# EasyEDA Pro project ProPrj_农装B类小车V2_2025-10-25.epro, board _1
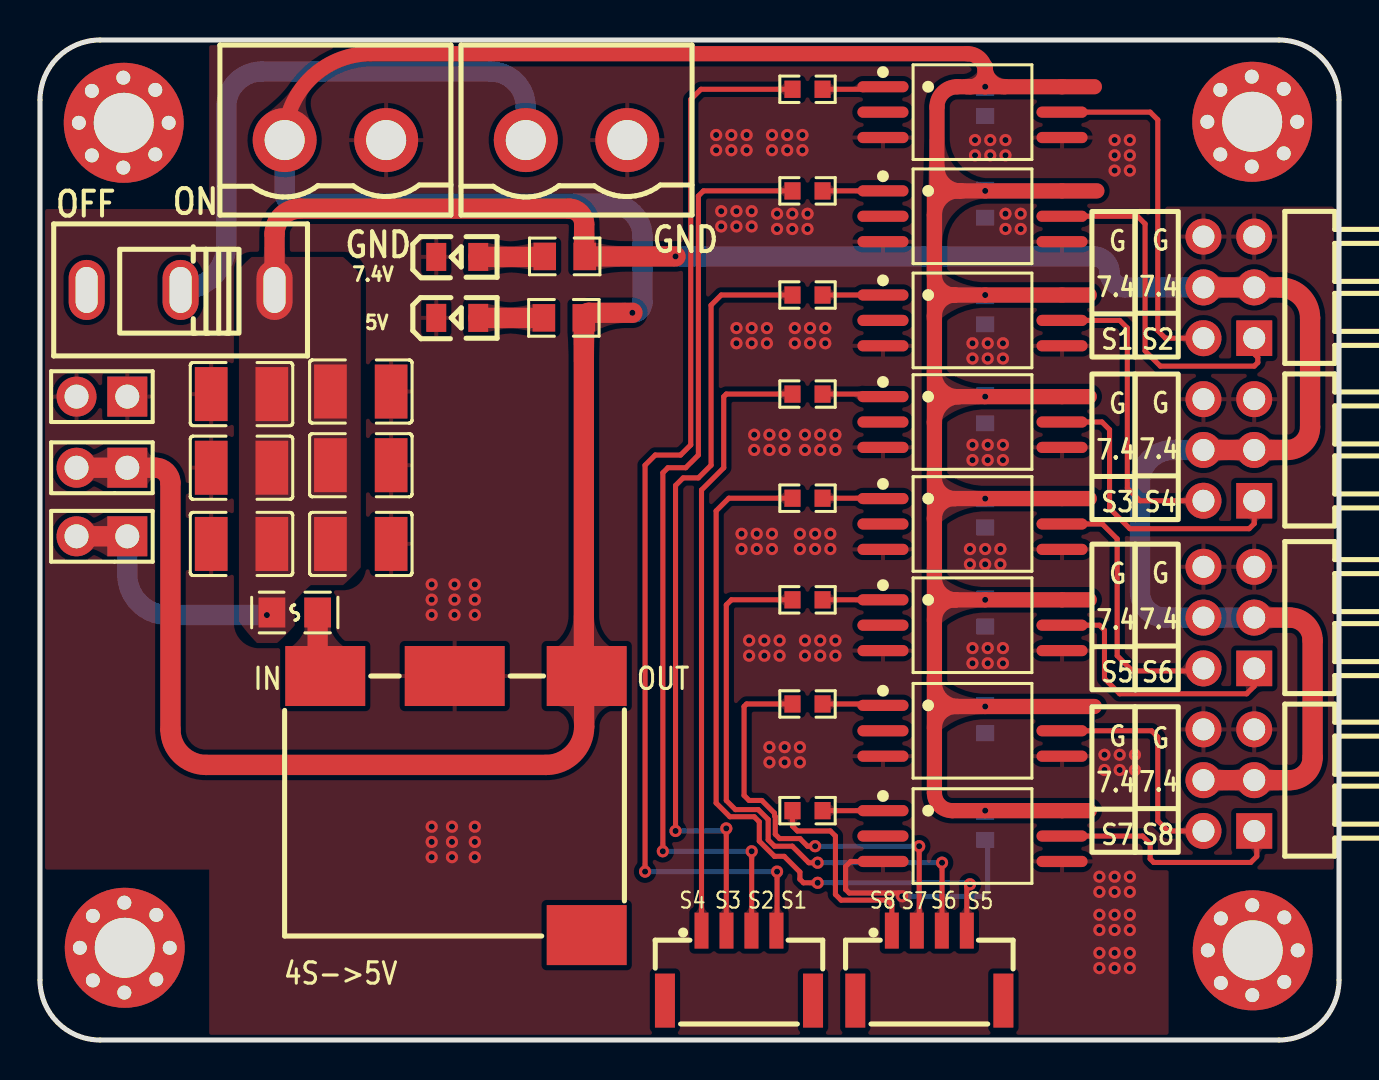
[diagram p6: board, top side]
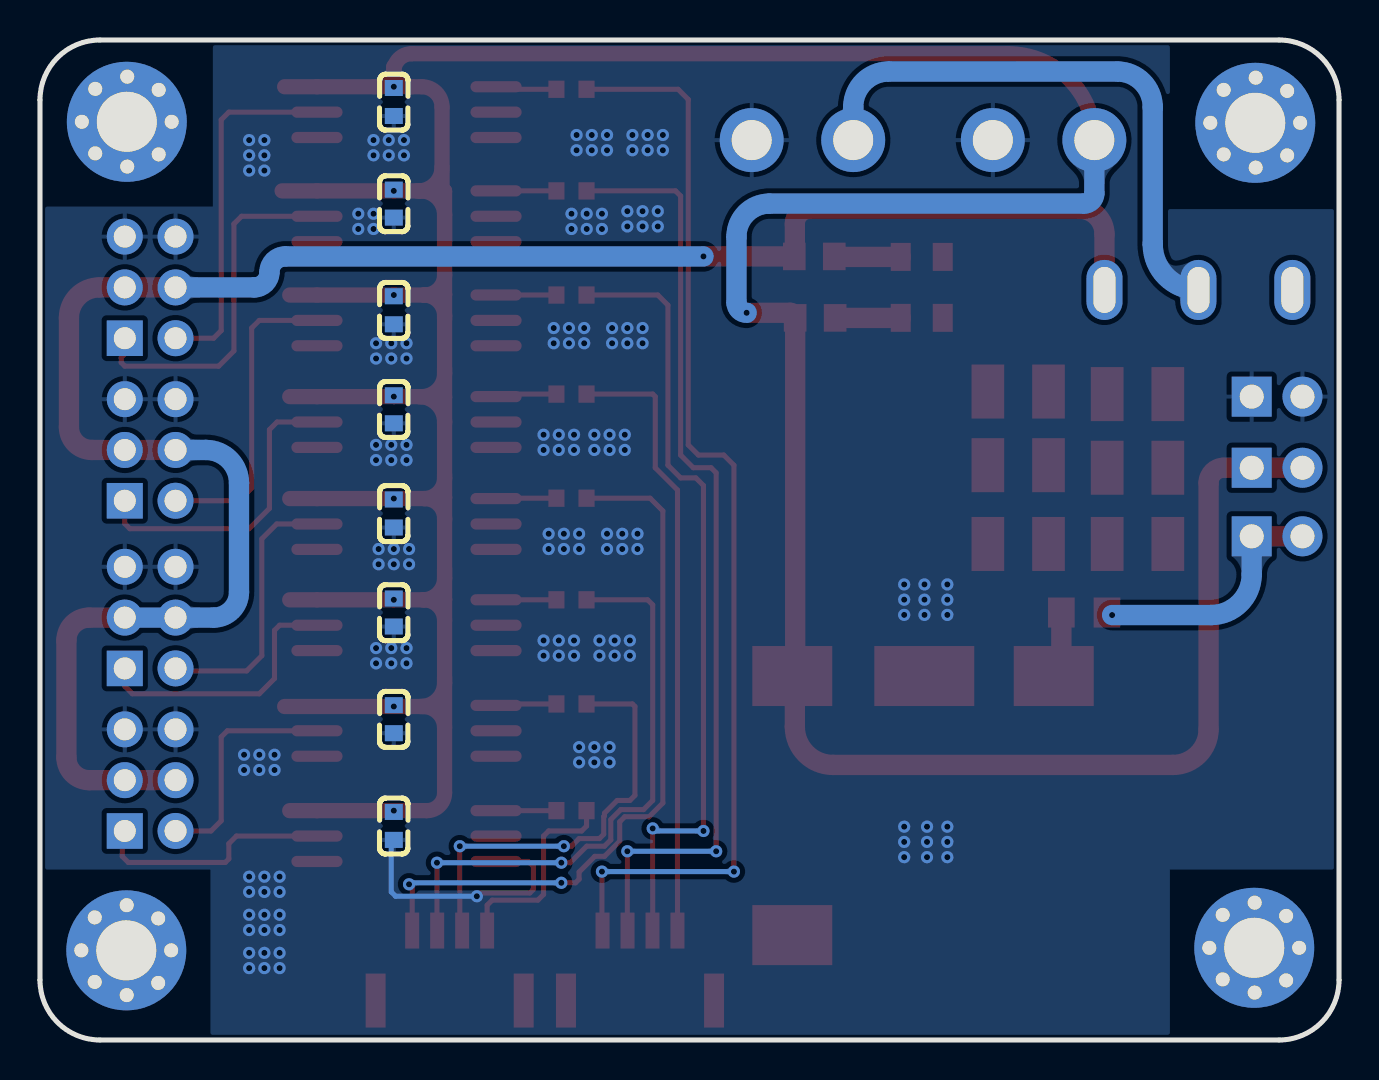
[diagram p7: board, bottom side, seen from below]

Outline 65 x 50 mm; copper layers: Top Layer, Bottom Layer. Coordinates in mm from the lower left corner of the outline.
Outline path: 0,47 0,3 arc(0.88,0.88) 3,0 62,0 arc(64.12,0.88) 65,3 65,47 arc(64.12,49.12) 62,50 3,50 arc(0.88,49.12) 0,47
Stack: Top Layer 0.035mm / Dielectric1 1.51mm FR4 er 4.5 / Bottom Layer 0.035mm

## Design rules (mm)
template: JLCPCB Capability(Two Layers Board)
spacing copperThickness1oz (default): track to track 0.102, other pairs 0.152 to 0.3
spacing copperThickness2oz: track to track 0.203, other pairs 0.152 to 0.3
track width copperThickness1oz (default): min 0.127, default 0.254, max 2.54
track width copperThickness2oz: min 0.203, default 0.254, max 2.54
differential pair differentialPair (default): width min 0.127, default 0.254, max 2.54; gap min 0.152, default 0.152
via viaSize (default): diameter min 0.5, default 0.61, max 10; hole min 0.3, default 0.305, max 6.3

## Placement (name value [footprint] x y rotation side)
5V  NCD0805R1  [LED0805-R-RD]  20.88 36.11 0 top
7.4V  NCD0805R1  [LED0805-R-RD]  20.88 39.15 0 top
C16  104  [C0603]  47.3 46.9 90 bottom
C64  104  [C0603]  47.3 41.82 90 bottom
C65  104  [C0603]  47.3 36.49 90 bottom
C66  104  [C0603]  47.3 31.53 90 bottom
C72  100uF  [C1210]  16.05 24.8 0 top
C73  100uF  [C1210]  16.05 28.74 0 top
C74  100uF  [C1210]  10.08 28.61 180 top
C75  100uF  [C1210]  16.05 32.42 0 top
C78  100uF  [C1210]  10.08 32.3 180 top
C79  104  [C0603]  47.3 16.04 90 bottom
C80  104  [C0603]  47.3 10.71 90 bottom
C81  104  [C0603]  47.3 21.37 90 bottom
C82  104  [C0603]  47.3 26.33 90 bottom
C83  100uF  [C1210]  10.08 24.8 180 top
CN24  DB2EVC-5.08-2P-GN  [CONN-TH_2P-P5.08_DB2EVC-5.08-2P]  26.85 45 180 top
CN34  DB2EVC-5.08-2P-GN  [CONN-TH_2P-P5.08_DB2EVC-5.08-2P]  14.78 45 180 top
CN48  GH125-S04DCA-00  [CONN-SMD_4P-P1.27_GH125-S04DCA-00]  34.98 3.72 0 top
CN49  GH125-S04DCA-00  [CONN-SMD_4P-P1.27_GH125-S04DCA-00]  44.5 3.72 0 top
F2  BSMD0805-075-6V  [F0805]  12.75 21.37 0 top
H11  PZ254V-11-02P  [HDR-TH_2P-P2.54-V-M]  3.1 28.61 180 top
H12  PZ254V-11-02P  [HDR-TH_2P-P2.54-V-M]  3.1 25.18 180 top
H13  PZ254V-11-02P  [HDR-TH_2P-P2.54-V-M]  3.1 32.17 180 top
H37  PH2.54-07-03PWS  [HDR-TH_6P-P2.54-H-M-R2-C3-S2.54-W12.3-N]  59.49 37.63 90 top
H38  PH2.54-07-03PWS  [HDR-TH_6P-P2.54-H-M-R2-C3-S2.54-W12.3-N]  59.49 29.5 90 top
H39  PH2.54-07-03PWS  [HDR-TH_6P-P2.54-H-M-R2-C3-S2.54-W12.3-N]  59.49 21.12 90 top
H41  PH2.54-07-03PWS  [HDR-TH_6P-P2.54-H-M-R2-C3-S2.54-W12.3-N]  59.49 12.99 90 top
NOREF  -  [Pad_e63]  58.41 45.91 270 top
NOREF#2  -  [Pad_e61]  60.63 43.67 180 top
NOREF#3  -  [Pad_e75]  60.66 6.74 180 top
NOREF#4  -  [Pad_e84]  2.65 2.98 0 top
NOREF#5  -  [Pad_e56]  4.19 45.86 180 top
NOREF#6  -  [Pad_e79]  5.82 6.26 0 top
NOREF#7  -  [Pad_e69]  62.26 2.9 0 top
NOREF#8  -  [Pad_e66]  60.66 45.91 180 top
NOREF#9  -  [Pad_e65]  60.63 48.17 180 top
NOREF#10  -  [Pad_e78]  4.22 6.87 180 top
NOREF#11  -  [Pad_e62]  59.06 44.28 0 top
NOREF#12  -  [Pad_e87]  4.24 4.61 180 top
NOREF#13  -  [Pad_e50]  6.44 45.86 270 top
NOREF#14  -  [Pad_e76]  62.26 6.13 0 top
NOREF#15  -  [Pad_e74]  59.08 6.08 0 top
NOREF#16  -  [Pad_e73]  58.43 4.48 270 top
NOREF#17  -  [Pad_e54]  1.95 45.86 270 top
NOREF#18  -  [Pad_e72]  59.08 2.85 0 top
NOREF#19  -  [Pad_e51]  5.77 44.28 0 top
NOREF#20  -  [Pad_e60]  62.23 44.33 0 top
NOREF#21  -  [Pad_e48]  4.17 48.12 180 top
NOREF#22  -  [Pad_e53]  2.59 44.23 0 top
NOREF#23  -  [Pad_e59]  62.91 45.91 270 top
NOREF#24  -  [Pad_e80]  6.49 4.61 270 top
NOREF#25  -  [Pad_e49]  5.77 47.51 0 top
NOREF#26  -  [Pad_e68]  62.93 4.48 270 top
NOREF#27  -  [Pad_e82]  4.22 2.37 180 top
NOREF#28  -  [Pad_e52]  4.17 43.62 180 top
NOREF#29  -  [Pad_e55]  2.59 47.46 0 top
NOREF#30  -  [Pad_e81]  5.82 3.03 0 top
NOREF#31  -  [Pad_e71]  60.66 2.24 180 top
NOREF#32  -  [Pad_e58]  62.23 47.56 0 top
NOREF#33  -  [Pad_e86]  2.65 6.21 0 top
NOREF#34  -  [Pad_e77]  60.68 4.48 180 top
NOREF#35  -  [Pad_e85]  2 4.61 270 top
NOREF#36  -  [Pad_e64]  59.06 47.51 0 top
R12  2K  [R0603]  38.4 47.54 180 top
R13  2K  [R0603]  38.4 42.46 180 top
R13_10K1  10K  [R0805]  26.21 36.11 180 top
R13_10K2  10K  [R0805]  26.25 39.18 180 top
R31  2K  [R0603]  38.4 37.25 180 top
R32  2K  [R0603]  38.4 32.3 180 top
R33  2K  [R0603]  38.4 11.47 180 top
R34  2K  [R0603]  38.4 16.8 180 top
R35  2K  [R0603]  38.4 22.01 180 top
R36  2K  [R0603]  38.4 27.09 180 top
U5  TLP715(TP,F)  [SOP-6_L6.8-W4.6-P1.27-LS10.2-BL]  46.66 46.39 270 top
U6  TLP715(TP,F)  [SOP-6_L6.8-W4.6-P1.27-LS10.2-BL]  46.66 41.19 270 top
U15  TLP715(TP,F)  [SOP-6_L6.8-W4.6-P1.27-LS10.2-BL]  46.66 35.98 270 top
U16  TLP715(TP,F)  [SOP-6_L6.8-W4.6-P1.27-LS10.2-BL]  46.66 30.9 270 top
U17  单刀双掷  [SW-TH_SS-12D10-G050]  7.04 37.5 180 top
U18  TLP715(TP,F)  [SOP-6_L6.8-W4.6-P1.27-LS10.2-BL]  46.66 10.2 270 top
U19  TLP715(TP,F)  [SOP-6_L6.8-W4.6-P1.27-LS10.2-BL]  46.66 15.46 270 top
U20  TLP715(TP,F)  [SOP-6_L6.8-W4.6-P1.27-LS10.2-BL]  46.66 20.74 270 top
U21  TLP715(TP,F)  [SOP-6_L6.8-W4.6-P1.27-LS10.2-BL]  46.66 25.8 270 top
U22  -  [4s降5v]  12.12 18.33 0 top

## Footprints (pads in the part's own frame, mm; a bottom-side part is the same pattern mirrored in y, then rotated)
4s降5v
  rect 4x3 smd: 1(2.159,-0.127) 3(15.24,-0.127) 4(15.24,-13.081)
  rect 5x3 smd: 2(8.636,-0.127)
C0603
  rect 0.8x0.9 smd: 1(-0.7,0) 2(0.7,0)
C1210
  rect 1.635x2.7 smd: 1(-1.518,0) 2(1.518,0)
CONN-SMD_4P-P1.27_GH125-S04DCA-00
  rect 0.7x1.8 smd: 1(-1.875,1.75) 2(-0.625,1.75) 3(0.625,1.75) 4(1.875,1.75)
  rect 1x2.7 smd: 5(3.705,-1.75) 6(-3.705,-1.75)
CONN-TH_2P-P5.08_DB2EVC-5.08-2P
  round 3.2 hole 2: 1(-2.54,0) 2(2.54,0)
F0805
  rect 1.335x1.5 smd: 1(-1.143,0) 2(1.143,0)
HDR-TH_2P-P2.54-V-M
  rect 2x2 hole 1.2: 1(-1.27,0)
  round 2 hole 1.2: 2(1.27,0)
HDR-TH_6P-P2.54-H-M-R2-C3-S2.54-W12.3-N
  rect 1.778x1.8 hole 1.1: 1(-2.54,-1.27)
  round 1.8 hole 1.1: 2(-2.54,1.27) 3(0,-1.27) 4(0,1.27) 5(2.54,-1.27) 6(2.54,1.27)
LED0805-R-RD
  rect 1x1.399 smd: 1(1.05,0) 2(-1.05,0)
Pad_e48
  round 1.2 hole 0.7: 1(0,0)
Pad_e49
  round 1.2 hole 0.7: 1(0,0)
Pad_e50
  round 1.2 hole 0.7: 1(0,0)
Pad_e51
  round 1.2 hole 0.7: 1(0,0)
Pad_e52
  round 1.2 hole 0.7: 1(0,0)
Pad_e53
  round 1.2 hole 0.7: 1(0,0)
Pad_e54
  round 1.2 hole 0.7: 1(0,0)
Pad_e55
  round 1.2 hole 0.7: 1(0,0)
Pad_e56
  round 6 hole 3: 1(0,0)
Pad_e58
  round 1.2 hole 0.7: 1(0,0)
Pad_e59
  round 1.2 hole 0.7: 1(0,0)
Pad_e60
  round 1.2 hole 0.7: 1(0,0)
Pad_e61
  round 1.2 hole 0.7: 1(0,0)
Pad_e62
  round 1.2 hole 0.7: 1(0,0)
Pad_e63
  round 1.2 hole 0.7: 1(0,0)
Pad_e64
  round 1.2 hole 0.7: 1(0,0)
Pad_e65
  round 1.2 hole 0.7: 1(0,0)
Pad_e66
  round 6 hole 3: 1(0,0)
Pad_e68
  round 1.2 hole 0.7: 1(0,0)
Pad_e69
  round 1.2 hole 0.7: 1(0,0)
Pad_e71
  round 1.2 hole 0.7: 1(0,0)
Pad_e72
  round 1.2 hole 0.7: 1(0,0)
Pad_e73
  round 1.2 hole 0.7: 1(0,0)
Pad_e74
  round 1.2 hole 0.7: 1(0,0)
Pad_e75
  round 1.2 hole 0.7: 1(0,0)
Pad_e76
  round 1.2 hole 0.7: 1(0,0)
Pad_e77
  round 6 hole 3: 1(0,0)
Pad_e78
  round 1.2 hole 0.7: 1(0,0)
Pad_e79
  round 1.2 hole 0.7: 1(0,0)
Pad_e80
  round 1.2 hole 0.7: 1(0,0)
Pad_e81
  round 1.2 hole 0.7: 1(0,0)
Pad_e82
  round 1.2 hole 0.7: 1(0,0)
Pad_e84
  round 1.2 hole 0.7: 1(0,0)
Pad_e85
  round 1.2 hole 0.7: 1(0,0)
Pad_e86
  round 1.2 hole 0.7: 1(0,0)
Pad_e87
  round 6 hole 3: 1(0,0)
R0603
  rect 0.806x0.864 smd: 1(-0.753,0) 2(0.753,0)
R0805
  rect 1.133x1.377 smd: 1(-1,0) 2(1,0)
SOP-6_L6.8-W4.6-P1.27-LS10.2-BL
  oval 0.56x2.56 smd: 1(-1.27,-4.48) 2(0,-4.48) 3(1.27,-4.48) 4(1.27,4.48) 5(0,4.48) 6(-1.27,4.48)
SW-TH_SS-12D10-G050
  oval 1.8x3 hole 1.1x2.3: 1(-4.7,0) 2(0,0) 3(4.7,0)

## Nets
GND: 5V.2 7.4V.2 C16.1 C64.1 C65.1 C66.1 C72.2 C73.2 C74.2 C75.2 C78.2 C79.1 C80.1 C81.1 C82.1 C83.2 CN24.1 CN34.1 H13.1 H13.2 H37.5 H37.6 H38.5 H38.6 H39.5 H39.6 H41.5 H41.6 U5.3 U5.4 U6.3 U6.4 U15.3 U15.4 U16.3 U16.4 U18.3 U18.4 U19.3 U19.4 U20.3 U20.4 U21.3 U21.4 U22.2
VCC5V: C16.2 C64.2 C65.2 C66.2 C79.2 C80.2 C81.2 C82.2 CN34.2 H11.1 H11.2 R13_10K1.1 U5.6 U6.6 U15.6 U16.6 U18.6 U19.6 U20.6 U21.6 U22.3
VCC7.4V: C72.1 C73.1 C74.1 C75.1 C78.1 C83.1 F2.1 H12.1 H12.2 H37.3 H37.4 H38.3 H38.4 H39.3 H39.4 H41.3 H41.4 R13_10K2.1 U17.1
O_STEER1: H37.2 U5.5
O_STEER2: H37.1 U6.5
O_STEER3: H38.2 U15.5
O_STEER4: H38.1 U16.5
O_STEER5: H39.2 U21.5
O_STEER6: H39.1 U20.5
O_STEER7: H41.2 U19.5
O_STEER8: H41.1 U18.5
POWER7.4V: CN24.2 U17.2
STEER1: CN48.4 R12.2
STEER2: CN48.3 R13.2
STEER3: CN48.2 R31.2
STEER4: CN48.1 R32.2
STEER5: CN49.4 R36.2
STEER6: CN49.3 R35.2
STEER7: CN49.2 R34.2
STEER8: CN49.1 R33.2
$1N5756: 7.4V.1 R13_10K2.2
$1N5759: 5V.1 R13_10K1.2
$1N5811: R32.1 U16.1
$1N5820: R31.1 U15.1
$1N5839: R13.1 U6.1
$1N5848: R12.1 U5.1
$1N7931: F2.2 U22.1
$1N9465: R33.1 U18.1
$1N9474: R34.1 U19.1
$1N9493: R35.1 U20.1
$1N9502: R36.1 U21.1

Pads without a net: CN48 5 6; CN49 5 6; NOREF 1; NOREF#2 1; NOREF#3 1; NOREF#4 1; NOREF#5 1; NOREF#6 1; NOREF#7 1; NOREF#8 1; NOREF#9 1; NOREF#10 1; NOREF#11 1; NOREF#12 1; NOREF#13 1; NOREF#14 1; NOREF#15 1; NOREF#16 1; NOREF#17 1; NOREF#18 1; NOREF#19 1; NOREF#20 1; NOREF#21 1; NOREF#22 1; NOREF#23 1; NOREF#24 1; NOREF#25 1; NOREF#26 1; NOREF#27 1; NOREF#28 1; NOREF#29 1; NOREF#30 1; NOREF#31 1; NOREF#32 1; NOREF#33 1; NOREF#34 1; NOREF#35 1; NOREF#36 1; U5 2; U6 2; U15 2; U16 2; U17 3; U18 2; U19 2; U20 2; U21 2; U22 4

## Via types
v1: diameter 0.61, hole 0.305, Top Layer to Bottom Layer, 184 vias

## Routing (per net, layer and track width the routed paths; a pad name or vN(x,y) marks a point on that pad's centre or on a via; arc(x,y) is an arc through that point)
GND: length 13.1
  Top Layer w0.254: U18.3 40.56,8.93 40.31,8.67 40.31,7.53 40.49,7.35 42.98,7.35 v1(43.14,7.19)
  Bottom Layer w0.254: C80.1 47.42,9.88 47.42,7.4 47.2,7.19 v1(43.14,7.19)
  vias: v1(19.6,22.78) v1(19.6,22.02) v1(19.6,21.25) v1(19.6,10.67) v1(19.6,9.9) v1(19.6,9.14) v1(20.62,10.67) v1(20.62,9.9) v1(20.62,9.14) v1(20.74,22.78) v1(20.74,22.02) v1(20.74,21.25) v1(21.76,22.78) v1(21.76,22.02) v1(21.76,21.25) v1(21.76,10.67) v1(21.76,9.9) v1(21.76,9.14) v1(33.83,45.25) v1(33.83,44.49) v1(34.09,41.44) v1(34.09,40.68) v1(34.59,45.25) v1(34.59,44.49) v1(34.85,41.44) v1(34.85,40.68) v1(34.85,35.6) v1(34.85,34.84) v1(35.1,25.31) v1(35.1,24.55) v1(35.36,45.25) v1(35.36,44.49) v1(35.48,19.98) v1(35.48,19.22) v1(35.61,41.44) v1(35.61,40.68) v1(35.61,35.6) v1(35.61,34.84) v1(35.74,30.26) v1(35.74,29.5) v1(35.86,25.31) v1(35.86,24.55) v1(36.25,19.98) v1(36.25,19.22) v1(36.37,35.6) v1(36.37,34.84) v1(36.5,30.26) v1(36.5,29.5) v1(36.5,14.64) v1(36.5,13.88) v1(36.63,45.25) v1(36.63,44.49) v1(36.63,25.31) v1(36.63,24.55) v1(36.88,41.31) v1(36.88,40.55) v1(37.01,19.98) v1(37.01,19.22) v1(37.26,30.26) v1(37.26,29.5) v1(37.26,14.64) v1(37.26,13.88) v1(37.39,45.25) v1(37.39,44.49) v1(37.64,41.31) v1(37.64,40.55) v1(37.77,35.6) v1(37.77,34.84) v1(38.02,25.31) v1(38.02,24.55) v1(38.02,14.64) v1(38.02,13.88) v1(38.15,45.25) v1(38.15,44.49) v1(38.28,30.26) v1(38.28,29.5) v1(38.28,19.98) v1(38.28,19.22) v1(38.4,41.31) v1(38.4,40.55) v1(38.53,35.6) v1(38.53,34.84) v1(38.79,25.31) v1(38.79,24.55) v1(39.04,30.26) v1(39.04,29.5) v1(39.04,19.98) v1(39.04,19.22) v1(39.29,35.6) v1(39.29,34.84) v1(39.55,25.31) v1(39.55,24.55) v1(39.8,30.26) v1(39.8,29.5) v1(39.8,19.98) v1(39.8,19.22) v1(46.53,24.55) v1(46.53,23.79) v1(46.66,34.84) v1(46.66,34.07) v1(46.66,29.76) v1(46.66,28.99) v1(46.66,19.6) v1(46.66,18.83) v1(46.79,45) v1(46.79,44.23) v1(47.3,24.55) v1(47.3,23.79) v1(47.42,34.84) v1(47.42,34.07) v1(47.42,29.76) v1(47.42,28.99) v1(47.42,19.6) v1(47.42,18.83) v1(47.55,45) v1(47.55,44.23) v1(48.06,24.55) v1(48.06,23.79) v1(48.18,34.84) v1(48.18,34.07) v1(48.18,29.76) v1(48.18,28.99) v1(48.18,19.6) v1(48.18,18.83) v1(48.31,45) v1(48.31,44.23) v1(48.31,41.31) v1(48.31,40.55) v1(49.07,41.31) v1(49.07,40.55) v1(53.01,8.17) v1(53.01,7.4) v1(53.01,6.26) v1(53.01,5.5) v1(53.01,4.36) v1(53.01,3.59) v1(53.26,14.26) v1(53.26,13.5) v1(53.77,45) v1(53.77,44.23) v1(53.77,43.47) v1(53.77,8.17) v1(53.77,7.4) v1(53.77,6.26) v1(53.77,5.5) v1(53.77,4.36) v1(53.77,3.59) v1(54.03,14.26) v1(54.03,13.5) v1(54.53,45) v1(54.53,44.23) v1(54.53,43.47) v1(54.53,8.17) v1(54.53,7.4) v1(54.53,6.26) v1(54.53,5.5) v1(54.53,4.36) v1(54.53,3.59) v1(54.79,14.26) v1(54.79,13.5)
VCC5V: length 255.4
  Top Layer w0.762: 44.75,36.05 44.75,36.21 arc(45.06,36.94) 45.8,37.25 45.75,37.25 arc(45.05,37.54) 44.75,38.25 44.75,41.26 arc(45.11,42.1) 45.95,42.46 46.06,42.46 ; 44.75,33.58 44.75,33.32 arc(45.09,32.51) 45.91,32.17 46.02,32.17 arc(45.13,31.8) 44.75,30.9 44.75,30.81 ; 44.75,28.28 44.75,28.1 arc(45.06,27.37) 45.78,27.07 45.75,27.07 arc(45.05,26.78) 44.75,26.08 44.75,26 ; 44.75,23.57 44.75,23.1 arc(45.07,22.33) 45.84,22.01 45.79,22.01 arc(45.06,21.7) 44.75,20.97 ; 44.75,18.13 44.75,17.86 arc(45.1,17.02) 45.94,16.67 45.83,16.67 arc(45.07,16.36) 44.75,15.6 ; 46.06,42.46 arc(45.23,42.8) 44.88,43.64 ; 46.06,42.46 46.16,42.46 ; 46.39,47.66 46.53,47.66 arc(47.07,47.89) 47.3,48.42 ; 47.3,48.68 47.3,48.64 arc(47.58,47.95) 48.27,47.66 ; 47.3,48.42 v1(47.3,47.66) ; 47.3,48.42 arc(47.03,49.05) 46.41,49.31 16.56,49.31 arc(13.51,48.05) CN34.2 ; 45.01,16.67 v1(47.3,16.67) 52.76,16.67 ; v1(47.3,47.66) U5.6 52.76,47.66 ; v1(47.3,47.66) 45.9,47.66 arc(45.18,47.37) 44.88,46.65 44.88,42.56 arc(44.91,42.49) 44.98,42.46 ; 44.75,37.28 44.75,42.44 arc(44.76,42.45) 44.77,42.46 44.98,42.46 ; 44.75,37.28 44.75,32.15 ; 44.75,37.28 arc(44.76,37.26) 44.79,37.25 v1(47.3,37.25) U15.6 52.5,37.25 ; 44.75,27.12 44.75,22.02 ; 44.75,27.12 44.75,32.15 ; 44.75,27.12 arc(44.77,27.09) 44.8,27.07 v1(47.3,27.07) U21.6 52.5,27.07 ; 44.75,22.02 44.75,12.36 arc(45.02,11.73) 45.64,11.47 v1(47.3,11.47) 52.5,11.47 ; 44.75,22.02 arc(44.76,22.01) 44.77,22.01 v1(47.3,22.01) U20.6 52.5,22.01 ; 44.98,42.46 v1(47.3,42.46) U6.6 52.88,42.46 ; 44.75,32.15 arc(44.76,32.16) 44.77,32.17 v1(47.3,32.17) U16.6 52.5,32.17
  Top Layer w1.016: H11.2 H11.1 5.77,28.61 arc(6.3,28.39) 6.53,27.85 6.53,15.53 arc(7.05,14.27) 8.31,13.75 25.32,13.75 arc(26.67,14.31) 27.23,15.66 27.23,18.2 arc(27.12,18.47) 26.85,18.58 ; v1(29.64,36.36) 27.47,36.36 arc(27.29,36.29) R13_10K1.1 27.21,18.34 arc(27.25,18.24) U22.3
  Bottom Layer w1.016: CN34.2 12.24,42.33 arc(12.39,41.97) 12.75,41.82 28.5,41.82 arc(29.67,41.34) 30.15,40.17 30.15,36.87 arc(30,36.51) v1(29.64,36.36)
VCC7.4V: length 114.7
  Top Layer w1.016: H41.4 62.53,12.99 arc(63.34,13.33) 63.68,14.14 63.68,19.98 arc(63.34,20.79) 62.53,21.12 60.76,21.12 ; U17.1 11.74,40.3 arc(12.11,41.2) 13,41.57 26.47,41.57 arc(27.01,41.34) 27.23,40.81 27.23,39.2 arc(27.24,39.19) R13_10K2.1 v1(31.8,39.18) ; H12.1 H12.2 ; H38.4 62.41,29.5 arc(63.22,29.84) 63.55,30.64 63.55,36.11 arc(63.1,37.18) 62.03,37.63 H37.4
  Bottom Layer w1.016: H37.4 54.28,37.63 arc(53.74,37.85) 53.52,38.39 arc(53.29,38.95) 52.73,39.18 v1(31.8,39.18) ; 60.76,21.12 H39.4 56.31,21.12 arc(55.41,21.49) 55.04,22.39 55.04,27.85 arc(55.53,29.02) 56.69,29.5 H38.4 ; v1(11.35,21.25) 6.4,21.25 arc(4.96,21.84) 4.37,23.28 H12.1
O_STEER1: length 17.9
  Top Layer w0.254: U5.5 55.55,46.39 55.93,46.01 55.93,35.47 56.31,35.09 H37.2
O_STEER2: length 18
  Top Layer w0.254: 60.76,35.09 60.76,34.31 60.94,34.13 60.94,33.87 60.76,33.69 56.06,33.69 55.3,34.45 55.3,40.81 54.92,41.19 U6.5
O_STEER3: length 15.5
  Top Layer w0.254: U15.5 54.03,35.98 54.41,35.6 54.41,27.6 55.04,26.96 H38.2
O_STEER4: length 15.4
  Top Layer w0.254: U16.5 53.14,30.9 53.52,30.52 53.52,26.58 54.53,25.56 60.5,25.56 60.76,25.82 60.76,26.96
O_STEER5: length 13.6
  Top Layer w0.254: H39.2 58.09,18.45 54.66,18.45 53.9,19.22 53.9,25.06 53.15,25.8 U21.5
O_STEER6: length 13.5
  Top Layer w0.254: U20.5 53.01,20.74 53.26,20.48 53.26,18.07 54.03,17.31 60.38,17.31 60.76,17.69 60.76,18.58
O_STEER7: length 11.6
  Top Layer w0.254: U19.5 55.62,15.46 55.93,15.15 55.93,10.96 56.44,10.45 H41.2
O_STEER8: length 12.2
  Top Layer w0.254: U18.5 55.17,10.2 55.55,9.82 55.55,9.06 55.73,8.88 60.58,8.88 60.88,9.18 60.88,10.33 60.76,10.45
POWER7.4V: length 29.1
  Bottom Layer w1.016: CN24.2 24.31,46.65 arc(23.79,47.9) 22.53,48.42 11.1,48.42 arc(9.84,47.9) 9.32,46.65 9.32,39.79 arc(8.65,38.17) U17.2
STEER1: length 55.2
  Top Layer w0.254: v1(30.28,8.42) 30.28,28.74 30.78,29.25 32.05,29.25 32.56,29.76 32.56,47.03 33.07,47.54 R12.2 ; v1(36.88,8.42) 36.88,5.5 CN48.4
  Bottom Layer w0.254: v1(30.28,8.42) v1(36.88,8.42)
STEER2: length 47.3
  Top Layer w0.254: CN48.3 35.61,5.48 v1(35.61,9.44) ; R13.2 33.2,42.46 32.94,42.2 32.94,29.25 32.31,28.61 31.42,28.61 31.17,28.36 v1(31.17,9.44)
  Bottom Layer w0.254: v1(31.17,9.44) v1(35.61,9.44)
STEER3: length 39.6
  Top Layer w0.254: v1(34.34,10.58) 34.34,5.48 CN48.2 ; 37.78,37.25 34.09,37.25 33.58,36.74 33.58,28.74 32.94,28.11 32.18,28.11 31.8,27.72 v1(31.8,10.45)
  Bottom Layer w0.254: v1(34.34,10.58) 34.21,10.45 v1(31.8,10.45)
STEER4: length 30.6
  Top Layer w0.254: CN48.1 33.1,27.5 34.21,28.61 34.21,32.17 34.34,32.3 R32.2
STEER5: length 36.2
  Top Layer w0.254: v1(38.91,7.86) 38.2,7.86 38.02,8.04 38.02,8.4 37.24,9.18 36.75,9.18 35.99,9.94 35.99,10.91 35.74,11.16 34.52,11.16 33.83,11.85 33.83,26.45 34.47,27.09 R36.2 ; CN49.4 46.38,7.63 v1(46.53,7.78)
  Bottom Layer w0.254: v1(38.91,7.86) 46.46,7.86 v1(46.53,7.78)
STEER6: length 29.3
  Top Layer w0.254: CN49.3 45.14,5.48 v1(45.14,8.86) ; v1(38.91,8.86) 38.47,8.86 37.64,9.69 36.75,9.69 36.44,10.01 36.44,11.02 35.94,11.52 34.8,11.52 34.34,11.98 34.34,21.75 34.59,22.01 R35.2
  Bottom Layer w0.254: v1(38.91,8.86) v1(45.14,8.86)
STEER7: length 21.6
  Top Layer w0.254: v1(38.79,9.69) 38.4,9.69 38.02,10.07 37.01,10.07 36.79,10.29 36.79,11.17 36.75,11.21 36.75,11.34 36.12,11.98 35.48,11.98 35.23,12.23 35.23,16.67 35.36,16.8 R34.2 ; v1(43.99,9.69) 43.99,5.59 CN49.2
  Bottom Layer w0.254: v1(38.79,9.69) v1(43.99,9.69)
STEER8: length 10.5
  Top Layer w0.254: CN49.1 42.63,6.74 42.37,6.99 40.09,6.99 39.8,7.28 39.8,10.2 39.55,10.45 37.9,10.45 37.65,10.7 37.65,11.59
$1N5756: length 3.3
  Top Layer w1.016: 7.4V.1 25.23,39.15 arc(25.25,39.16) R13_10K2.2
$1N5759: length 3.3
  Top Layer w1.016: R13_10K1.2 5V.1
$1N5811: length 3.1
  Top Layer w0.254: U16.1 42.05,32.3 R32.1
$1N5820: length 3
  Top Layer w0.254: R31.1 U15.1
$1N5839: length 3
  Top Layer w0.254: R13.1 U6.1
$1N5848: length 3.1
  Top Layer w0.254: U5.1 42.05,47.54 R12.1
$1N7931: length 3.4
  Top Layer w1.016: F2.2 13.89,18.58 arc(14.01,18.31) U22.1
$1N9465: length 3
  Top Layer w0.254: R33.1 42.18,11.47
$1N9474: length 3.1
  Top Layer w0.254: R34.1 42.11,16.8 U19.1
$1N9493: length 3
  Top Layer w0.254: R35.1 U20.1
$1N9502: length 3
  Top Layer w0.254: R36.1 42.16,27.09 U21.1

## Copper pours and planes (outline as drawn; the poured copper is in the pictures)
GND on Top Layer: -4.78,53.76 67.23,53.76 67.23,-6.82 -4.78,-6.82
GND on Bottom Layer: -6.68,58.2 74.6,58.2 74.6,-5.8 -6.68,-5.8
VCC7.4V on Top Layer: 9.96,39.15 16.05,39.15 16.05,19.85 9.96,19.85

Small or netless copper shapes (teardrops, artwork), in the pictures only: 93 on Top Layer, 19 on Bottom Layer

## Text on the board
Top Silkscreen Layer: S4 | S3 | S2 | S1 | S8 | S7 | S6 | S5 | 7.4 | G | IN | 4S->5V | OUT | OFF | ON | GND
